# Altium schematic sheet Fibras2Reles.SchDoc
size A4
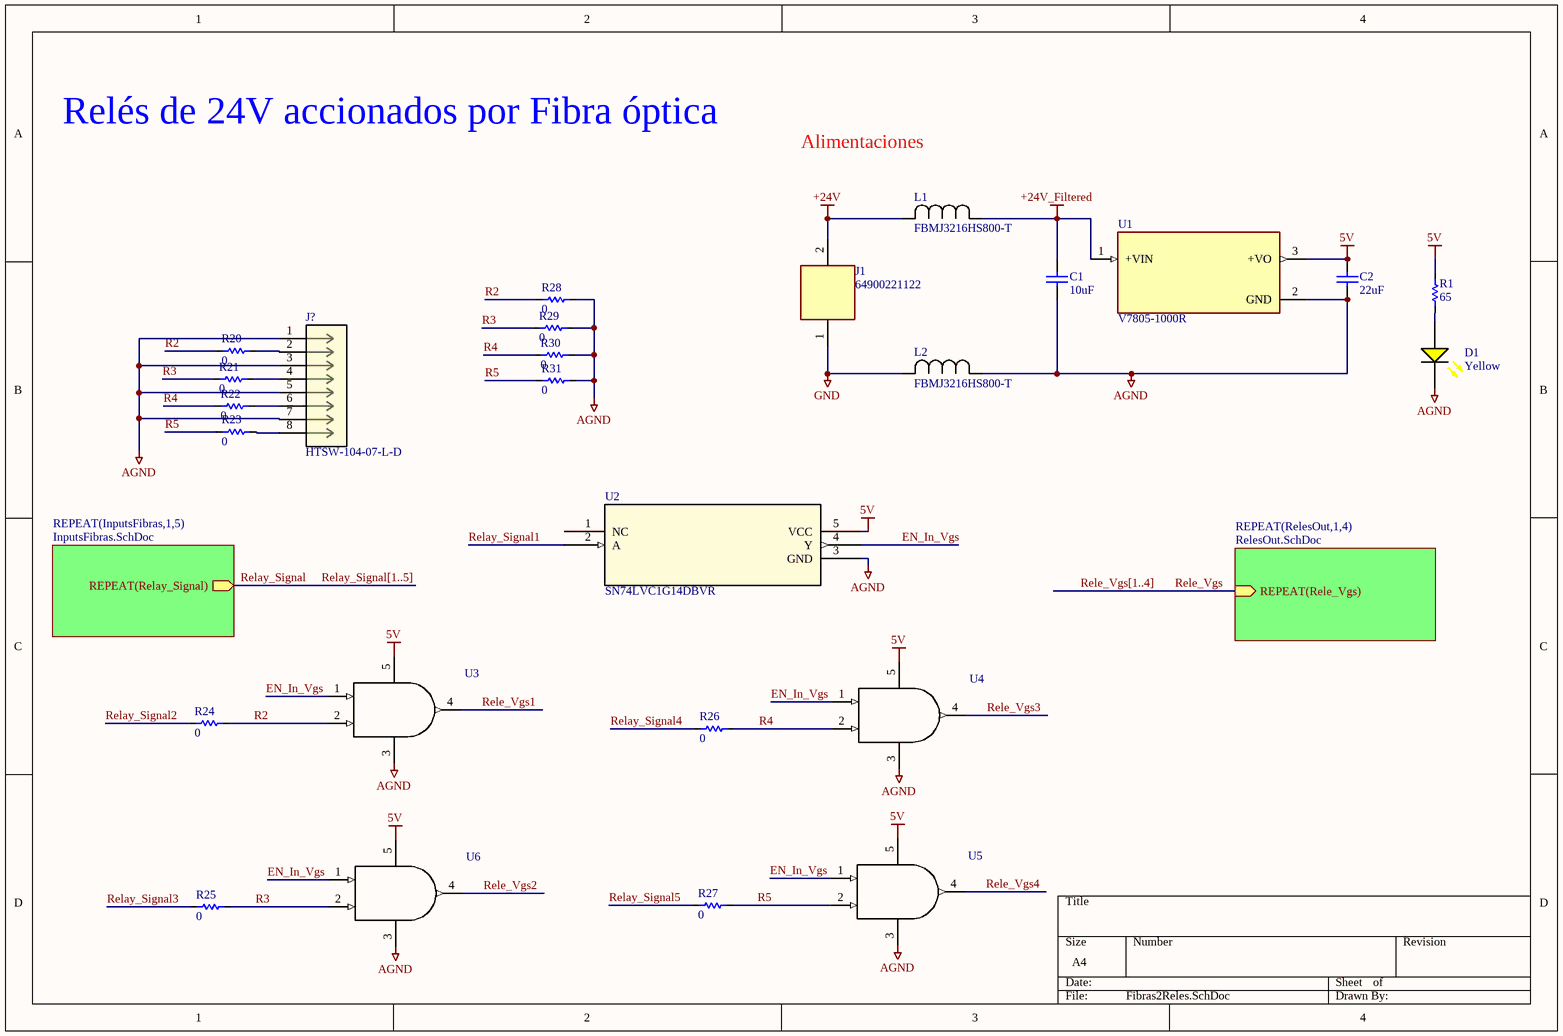
[diagram p0: Fibras2Reles.SchDoc]

## Parts
C1  10uF  [CAP_0603]
C2  22uF  [CAP_0603]
D1  Yellow  [LED_0603_Yellow]
J1  64900221122  [64900221122]
J?  HTSW-104-07-L-D  [CON8_2X4_TU_TSW_SAI]
L1  FBMJ3216HS800-T  [IND_16HS800-T_TAY-M]
L2  FBMJ3216HS800-T  [IND_16HS800-T_TAY-M]
R1  65  [RES_0805]
R20  0  [RES_0805]
R21  0  [RES_0805]
R22  0  [RES_0805]
R23  0  [RES_0805]
R24  0  [RES_0805]
R25  0  [RES_0805]
R26  0  [RES_0805]
R27  0  [RES_0805]
R28  0  [RES_0805]
R29  0  [RES_0805]
R30  0  [RES_0805]
R31  0  [RES_0805]
U1  V7805-1000R  [CONV_V7805-1000R]
U2  SN74LVC1G14DBVR  [DBV5-M]
U3  SN74LVC1G08DBVR  [DBV0005A_N]  (value not drawn)
U4  SN74LVC1G08DBVR  [DBV0005A_N]  (value not drawn)
U5  SN74LVC1G08DBVR  [DBV0005A_N]  (value not drawn)
U6  SN74LVC1G08DBVR  [DBV0005A_N]  (value not drawn)

## Sub-sheets
REPEAT(InputsFibras,1,5) = InputsFibras.SchDoc: REPEAT(Relay_Signal) (out)
REPEAT(RelesOut,1,4) = RelesOut.SchDoc: REPEAT(Rele_Vgs) (in)

## Nets
5V: C2.1 R1.2 U1.3(+VO) U2.5(VCC) U3.5(V+) U4.5(V+) U5.5(V+) U6.5(V+)
+24V: J1.2 L1.2
+24V_Filtered: C1.1 L1.1 U1.1(+VIN)
AGND: C1.2 C2.2 D1.2(K) J?.1 J?.3 J?.5 J?.7 L2.1 R28.1 R29.1 R30.1 R31.1 U1.2(GND) U2.3(GND) U3.3(V-) U4.3(V-) U5.3(V-) U6.3(V-)
GND: J1.1 L2.2
EN_In_Vgs: U2.4(Y) U3.1(A) U4.1(A) U5.1(A) U6.1(A)
R2: R20.2 R24.1 R28.2 U3.2(B)
R3: R21.2 R25.1 R29.2 U6.2(B)
R4: R22.2 R26.1 R30.2 U4.2(B)
R5: R23.2 R27.1 R31.2 U5.2(B)
Relay_Signal: sheet REPEAT(InputsFibras,1,5)/REPEAT(Relay_Signal)
Relay_Signal1: U2.2(A)
Relay_Signal2: R24.2
Relay_Signal3: R25.2
Relay_Signal4: R26.2
Relay_Signal5: R27.2
Rele_Vgs: sheet REPEAT(RelesOut,1,4)/REPEAT(Rele_Vgs)
Rele_Vgs1: U3.4(Y)
Rele_Vgs2: U6.4(Y)
Rele_Vgs3: U4.4(Y)
Rele_Vgs4: U5.4(Y)
NetD1_1: D1.1(A) R1.1
NetJ?_2: J?.2 R20.1
NetJ?_4: J?.4 R21.1
NetJ?_6: J?.6 R22.1
NetJ?_8: J?.8 R23.1

Not connected (* = marked no-connect by the designer): U2 1(NC)

## Buses and harness runs
bus Relay_Signal[1..5]
bus Rele_Vgs[1..4]

## Notes on the sheet
- Relés de 24V accionados por Fibra óptica
- Alimentaciones

## Library data of the parts
C1 C2 = Cap_0603: 0.1µF ±10% 50V Ceramic Capacitor X7R 0603 (1608 Metric); MF: KEMET; MFP: C0603C104K5RACTU; Value: 100nF; Created: 2020_06_15_DAarancibia; Package: 0603; Supplier 1: Digi-Key; Supplier Part Number 1: 399-5089-1-ND
D1 = Led_0603_Yellow: Yellow 590nm LED Indication - Discrete 2V 0603 (1608 Metric); MF: Würth Elektronik; MFP: 150060YS75000; Created: 2020_07_06_DAarancibia; Package: 0603; Value: Yellow; Supplier 1: Digi-Key; Supplier Part Number 1: 732-4981-1-ND
J1 = 64900221122: Connector Header Through Hole 2 position -; MF: WÃ¼rth Elektronik; Price: None; Package: None; Purchase-URL: https://pricing.snapeda.com/search/part/64900221122/?ref=eda; Availability: In Stock; SnapEDA_Link: https://www.snapeda.com/parts/64900221122/Wurth+Elektronik/view-part/?ref=snap; Value: *; MP: 64900221122; Check_prices: https://www.snapeda.com/parts/64900221122/Wurth+Elektronik/view-part/?ref=eda
J? = HTSW-104-07-L-D: No Description Available; Mfr_Name: Samtec Inc; Copyright: Copyright (C) 2023 Ultra Librarian. All rights reserved.; Manufacturer_Part_Number: HTSW-104-07-L-D; RefDes: RefDes; Type: DEV
L1 L2 = FBMJ3216HS800-T: No Description Available; Mfr_Name: Taiyo Yuden; Type: DEV; Copyright: Copyright (C) 2023 Ultra Librarian. All rights reserved.; Manufacturer_Part_Number: FBMJ3216HS800-T; RefDes: RefDes
R1 R20-R31 = Res_0805: 10 kOhms ±1% 0.125W, 1/8W Chip Resistor 0805 (2012 Metric) Automotive AEC-Q200 Thick Film; MF: Panasonic Electronic Components; MFP: ERJ-6ENF1002V; Value: 10k; Created: 2020_06_15_DAarancibia; Package: 0805; Supplier 1: Digi-Key; Supplier Part Number 1: P10.0KCCT-ND
U1 = V7805-1000R: 1 A Output Current, 4.75~32 Vdc Input, Right Angle 3 Pin SIP,  Non-Isolated, Dc-Dc Converter; MF: CUI Inc.; SnapEDA_Link: https://www.snapeda.com/parts/V7805-1000R/CUI/view-part/2782787/?ref=snap; CUI_purchase_URL: https://www.cui.com/product/dc-dc-converters/non-isolated/v78-1000r-series?utm_source=snapeda.com&utm_medium=referral&utm_campaign=snapedaBOM; MP: V7805-1000R; Package: SIP-3 CUI; Value: *; Digi-Key_Purchase_URL: https://www.digikey.com/product-detail/en/cui-inc/V7805-1000R/102-2178-ND/2352137?utm_source=snapeda&utm_medium=aggregator&utm_campaign=symbol; Digi-Key_Part_Number: 102-2178-ND
U2 = SN74LVC1G14DBVR: No Description Available; Mfr_Name: Texas Instruments; Copyright: Copyright (C) 2023 Ultra Librarian. All rights reserved.; Manufacturer_Part_Number: SN74LVC1G14DBVR; RefDes: RefDes; Type: DEV
U3-U6 = SN74LVC1G08DBVR: No Description Available; Mfr_Name: Texas Instruments; Alternate_PartNumber: SN74LVC1G08DBVT; CompType: IC; Type: DEV; RefDes: RefDes; Copyright: Copyright (C) 2023 Ultra Librarian. All rights reserved.; Manufacturer_Part_Number: SN74LVC1G08DBVR; Application_BuildNumber: *; PartNumber: SN74LVC1G08DBVR; PackageReference: DBV0005A; MountType: SMT; RoHS: Y; Manufacturer: Texas Instruments